# Altium schematic sheet ft2232d.SchDoc
size A4
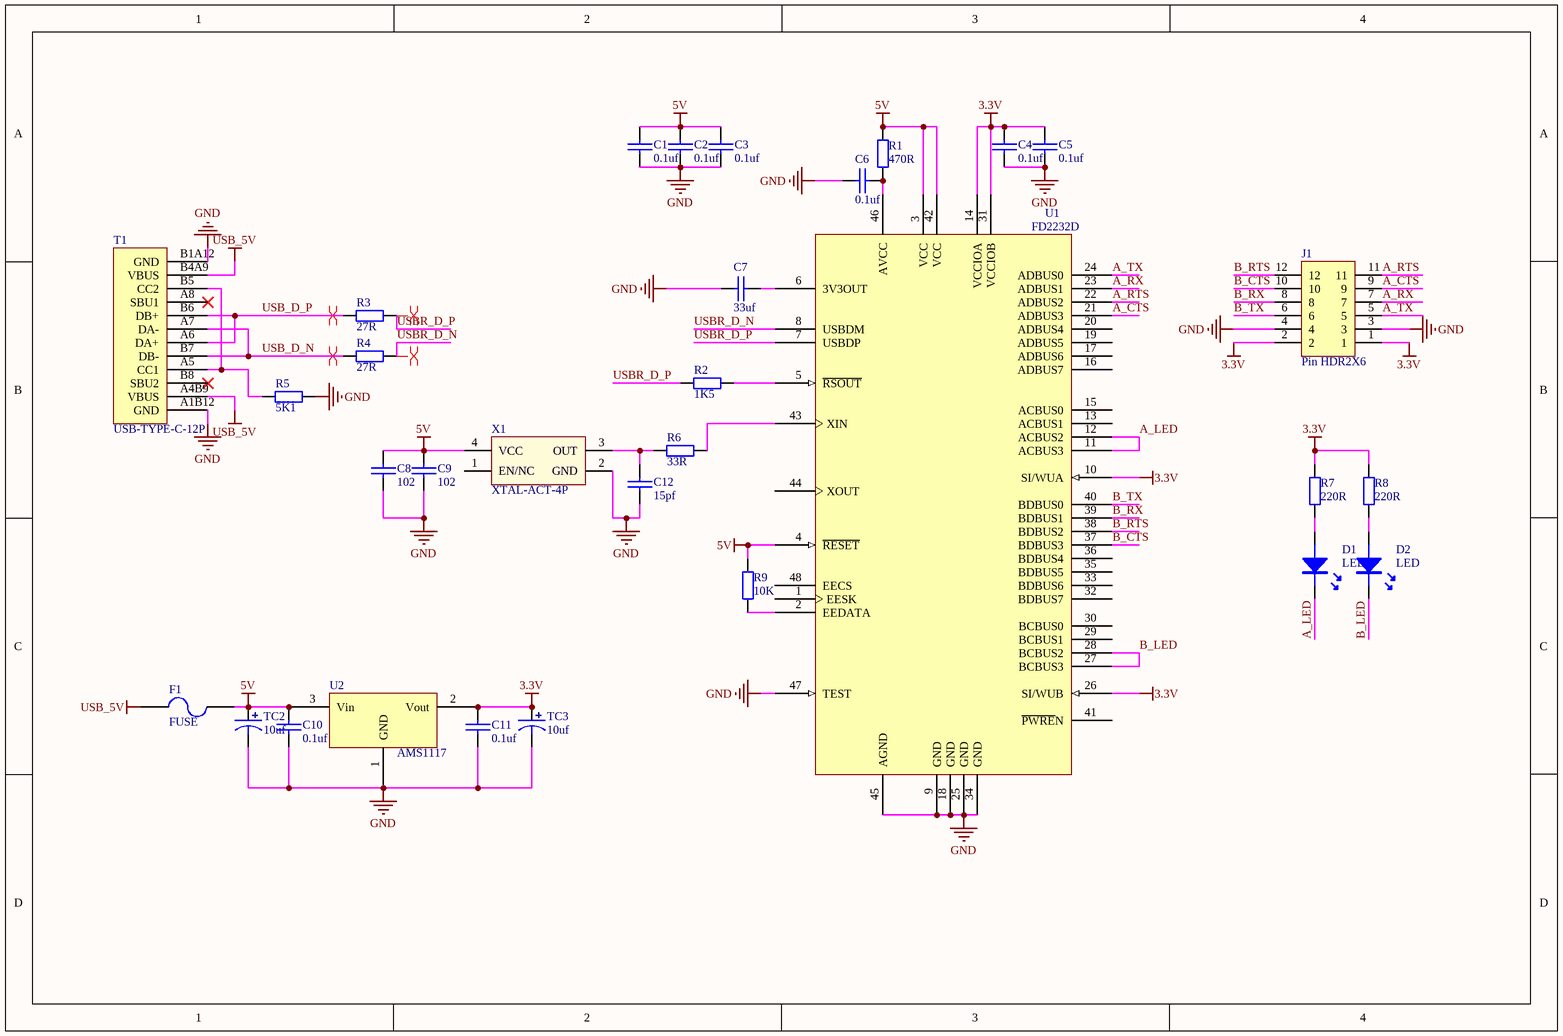
[diagram p0: ft2232d.SchDoc]

## Parts
C1  0.1uf  [0603C]
C2  0.1uf  [0603C]
C3  0.1uf  [0603C]
C4  0.1uf  [0603C]
C5  0.1uf  [0603C]
C6  0.1uf  [0603C]
C7  33uf  [0603C]
C8  102  [0603C]
C9  102  [0603C]
C10  0.1uf  [0603C]
C11  0.1uf  [0603C]
C12  15pf  [0603C]
D1  LED  [LED-0603B]
D2  LED  [LED-0603B]
F1  FUSE  [FUSE-1210]
J1  Pin HDR2X6  [Pin HDR2X6/2.54mm-S]
R1  470R  [0603R]
R2  1K5  [0603R]
R3  27R  [0603R]
R4  27R  [0603R]
R5  5K1  [0603R]
R6  33R  [0603R]
R7  220R  [0603R]
R8  220R  [0603R]
R9  10K  [0603R]
T1  USB-TYPE-C-12P  [type-c-12p]
TC2  10uf  [TAJ-A/3216]
TC3  10uf  [TAJ-A/3216]
U1  FD2232D  [LQFP48 7X7]
U2  AMS1117  [SOT223]
X1  XTAL-ACT-4P  [OSC-5032-4P-2]

## Nets
3.3V: C4.2 C5.2 C11.2 J1.1 J1.2 R7.1 R8.1 TC3.1 U1.10(SI/WUA) U1.14(VCCIOA) U1.26(SI/WUB) U1.31(VCCIOB) U2.2(Vout)
5V: C1.2 C2.2 C3.2 C8.2 C9.2 C10.2 F1.2 R1.1 R9.1 TC2.1 U1.3(VCC) U1.4(~{RESET}) U1.42(VCC) U2.3(Vin) X1.4(VCC)
GND: C1.1 C2.1 C3.1 C4.1 C5.1 C6.2 C7.2 C8.1 C9.1 C10.1 C11.1 C12.1 J1.3 J1.4 R5.1 T1.A1B12(GND) T1.B1A12(GND) TC2.2 TC3.2 U1.9(GND) U1.18(GND) U1.25(GND) U1.34(GND) U1.45(AGND) U1.47(TEST) U2.1(GND) X1.2(GND)
USB_5V: F1.1 T1.A4B9(VBUS) T1.B4A9(VBUS)
A_CTS: J1.9 U1.21(ADBUS3)
A_LED: D1.K U1.11(ACBUS3) U1.12(ACBUS2)
A_RTS: J1.11 U1.22(ADBUS2)
A_RX: J1.7 U1.23(ADBUS1)
A_TX: J1.5 U1.24(ADBUS0)
B_CTS: J1.10 U1.37(BDBUS3)
B_LED: D2.K U1.27(BCBUS3) U1.28(BCBUS2)
B_RTS: J1.12 U1.38(BDBUS2)
B_RX: J1.8 U1.39(BDBUS1)
B_TX: J1.6 U1.40(BDBUS0)
USB_D_N: R4.2 T1.A7(DA-) T1.B7(DB-)
USB_D_P: R3.2 T1.A6(DA+) T1.B6(DB+)
USBR_D_N: R4.1 U1.8(USBDM)
USBR_D_P: R2.2 R3.1 U1.7(USBDP)
NetC6_1: C6.1 R1.2 U1.46(AVCC)
NetC7_1: C7.1 U1.6(3V3OUT)
NetC12_2: C12.2 R6.2 X1.3(OUT)
NetD1_A: D1.A R7.2
NetD2_A: D2.A R8.2
NetR2_1: R2.1 U1.5(~{RSOUT})
NetR5_2: R5.2 T1.A5(CC1) T1.B5(CC2)
NetR6_1: R6.1 U1.43(XIN)
NetR9_2: R9.2 U1.2(EEDATA)

Not connected (* = marked no-connect by the designer): T1 A8(SBU1)* B8(SBU2)*; U1 1(EESK) 13(ACBUS1) 15(ACBUS0) 16(ADBUS7) 17(ADBUS6) 19(ADBUS5) 20(ADBUS4) 29(BCBUS1) 30(BCBUS0) 32(BDBUS7) 33(BDBUS6) 35(BDBUS5) 36(BDBUS4) 41(~{PWRE}N) 44(XOUT) 48(EECS); X1 1(EN/NC)

## Layout directives
differential pair: USB_D_N, USB_D_P, USBR_D_N, USBR_D_P

## Library data of the parts
C1-C12 = CAP: 无极性电容
R1-R9 = RES: 贴片电阻
TC2 TC3 = TCAP: 钽电容
U2 = AMS1117: 三端稳压芯片
X1 = XTAL-ACT-4P: 4脚有源晶振